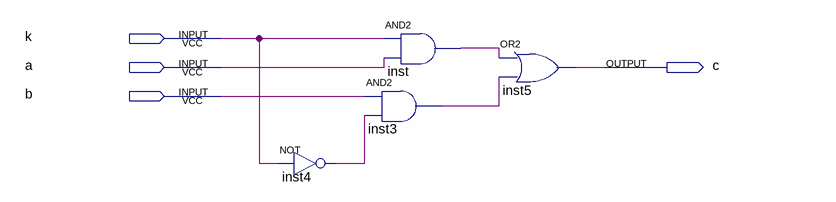
[diagram p0: schematic sheet]
// Quartus schematic 2to1.bdf as structural Verilog: 4 symbols, 4 pins
module \2to1  (
  input  k,
  input  a,
  input  b,
  output c
);

  wire inst3_out, inst4_out, inst_out;

  not inst4 (inst4_out, k);
  and inst3 (inst3_out, b, inst4_out);
  and inst (inst_out, k, a);
  or inst5 (c, inst_out, inst3_out);
endmodule
